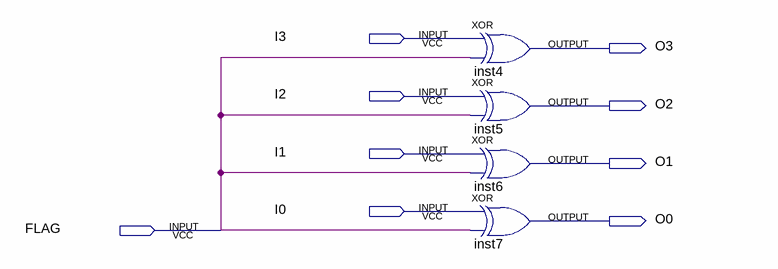
[diagram p0: schematic sheet]
// Quartus schematic 4InputXOR.bdf as structural Verilog: 4 symbols, 9 pins
module \4InputXOR  (
  input  I3,
  input  I2,
  input  I1,
  input  I0,
  input  FLAG,
  output O3,
  output O2,
  output O1,
  output O0
);

  xor inst4 (O3, I3, FLAG);
  xor inst5 (O2, I2, FLAG);
  xor inst6 (O1, I1, FLAG);
  xor inst7 (O0, I0, FLAG);
endmodule
